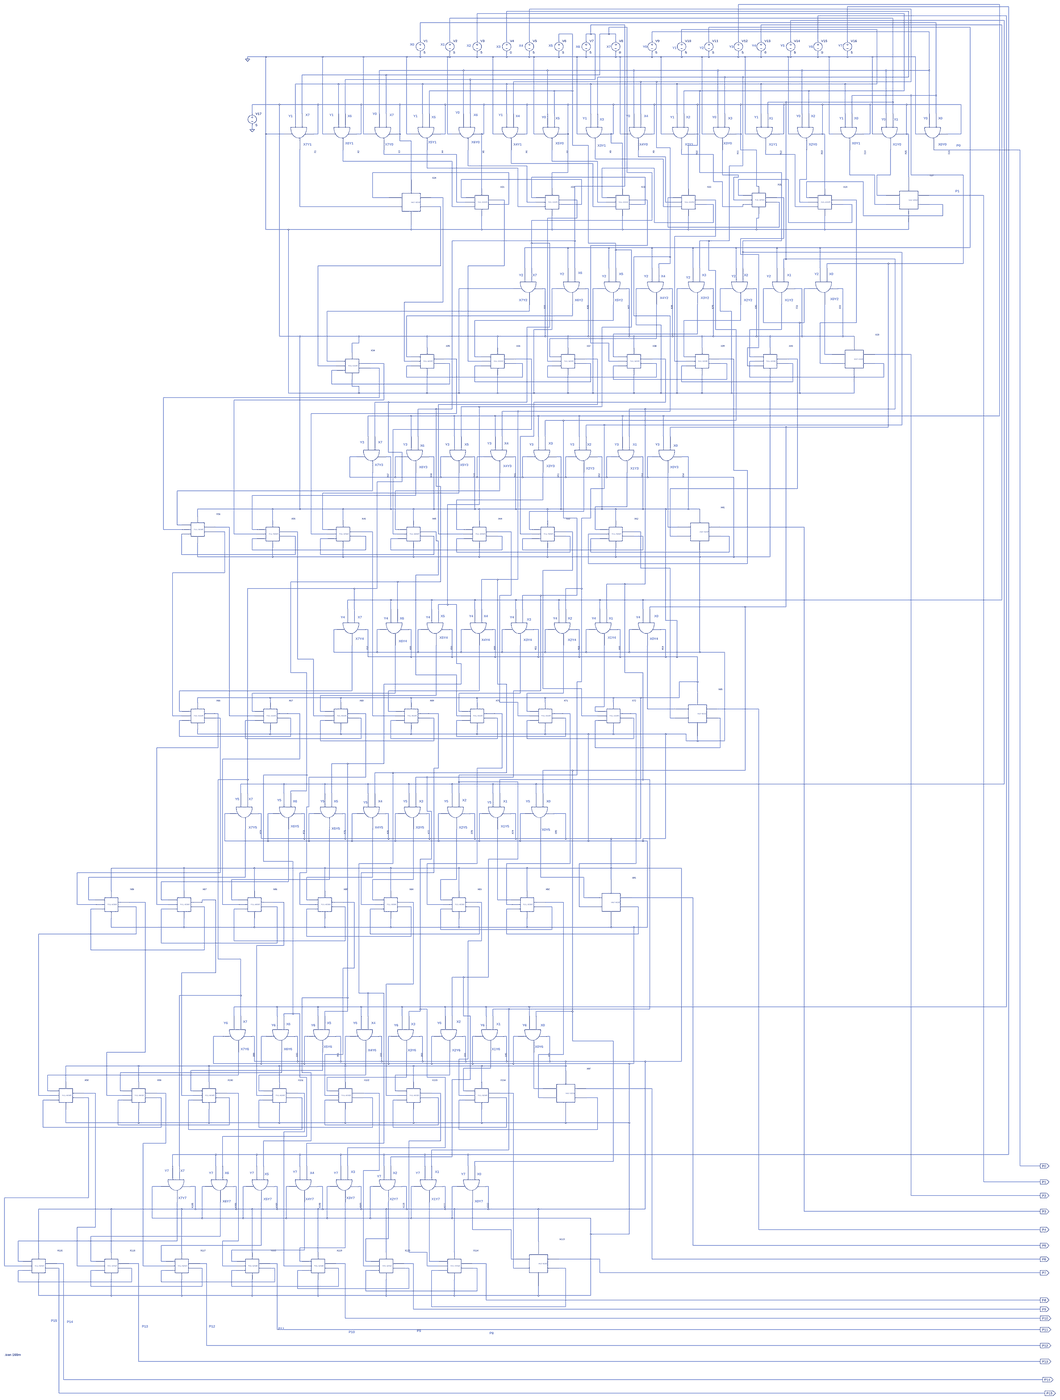
[diagram p0: schematic multi8bitimply.asc, whole sheet]
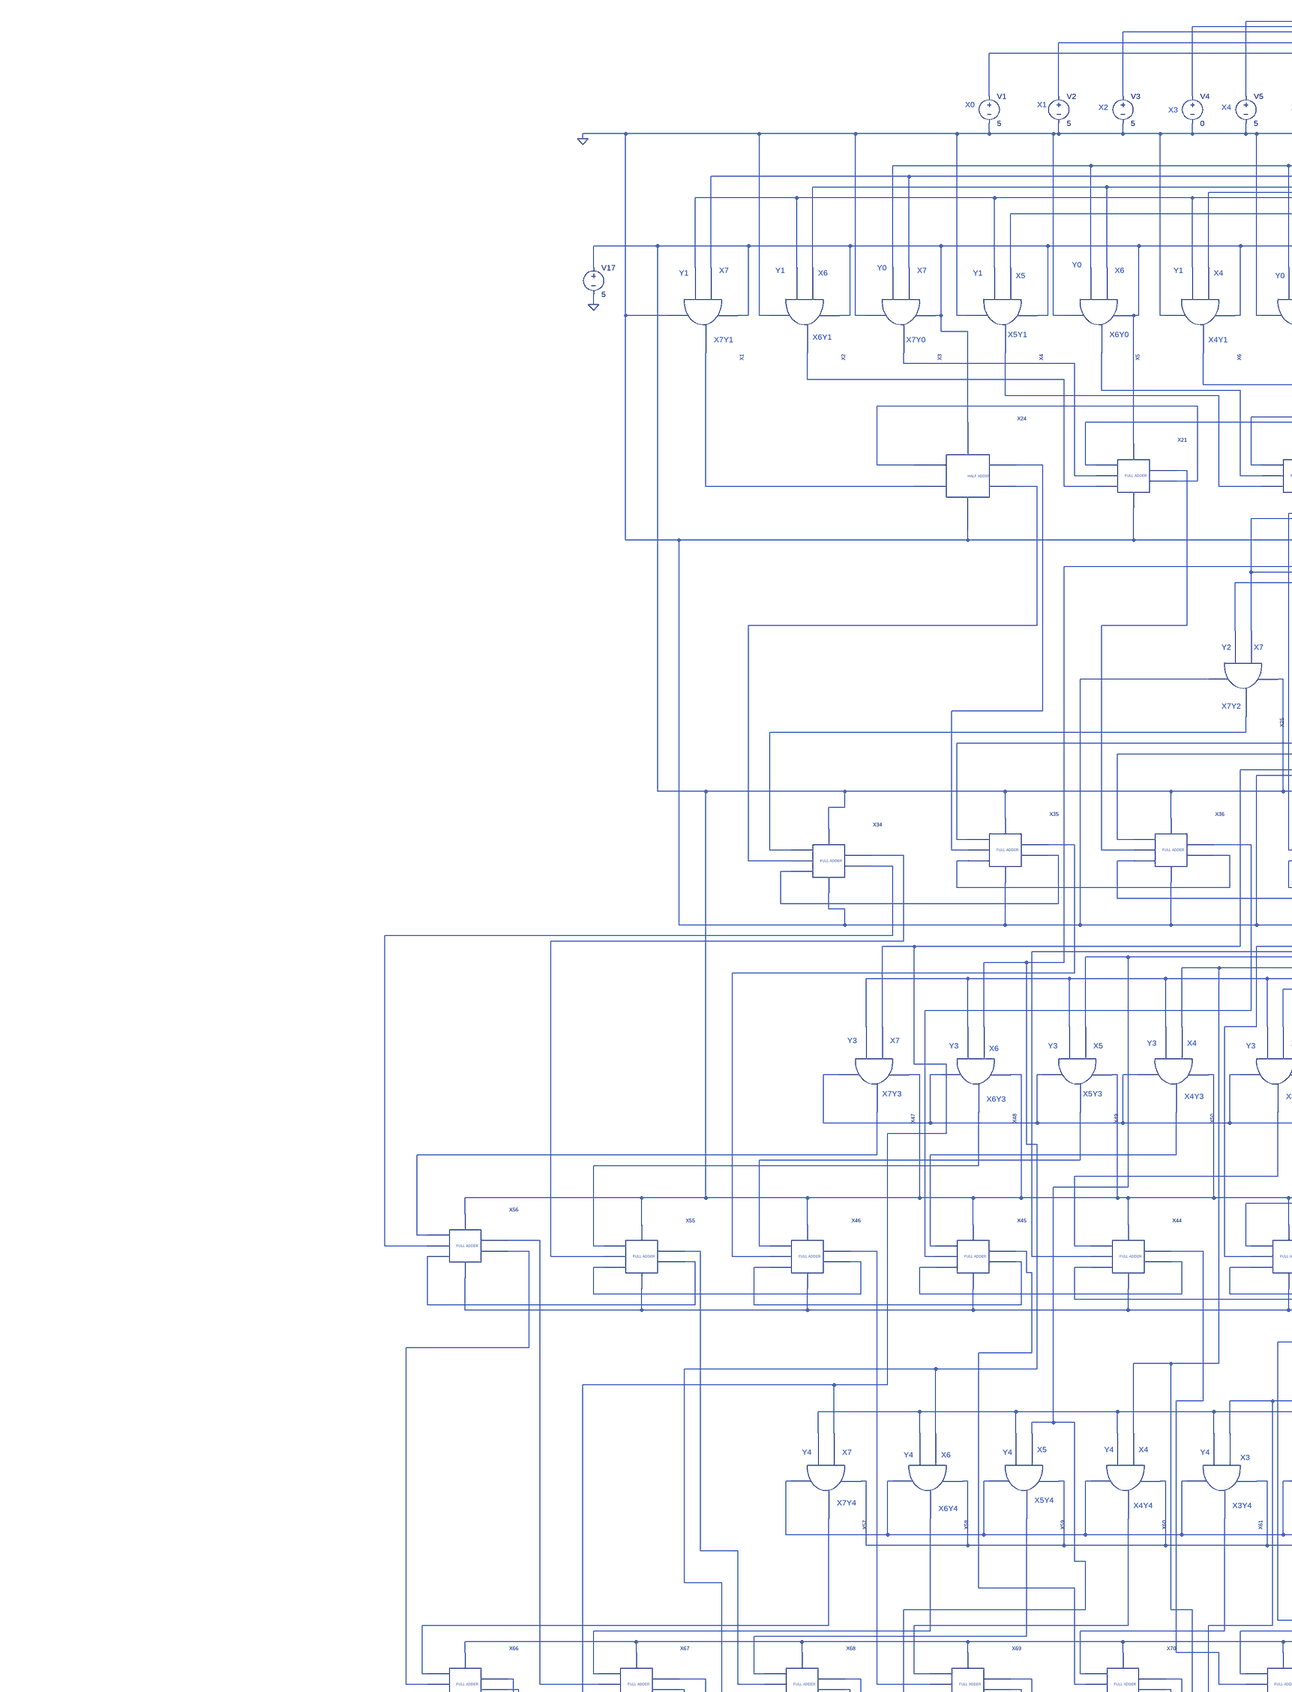
[diagram p1: schematic multi8bitimply.asc, part, row 1 of 2, column 1 of 2]
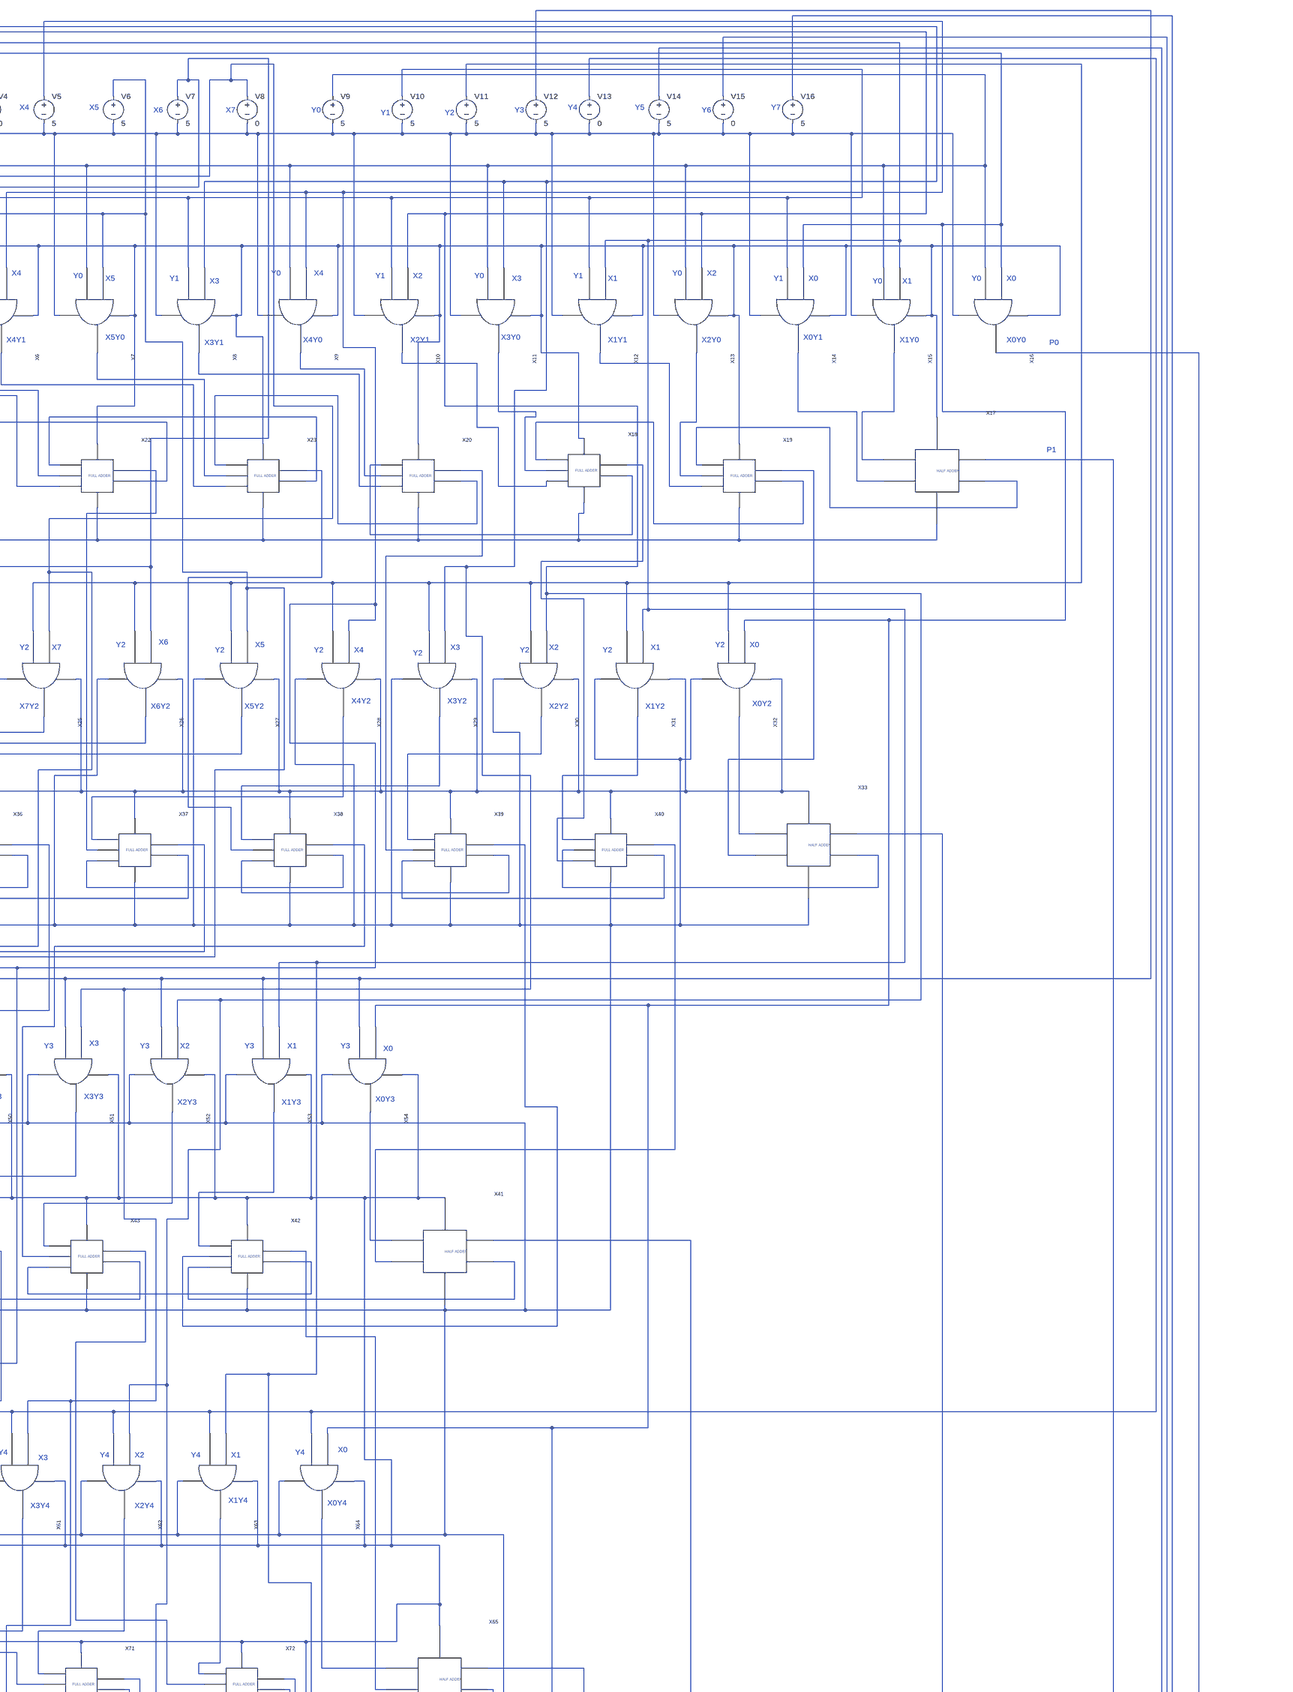
[diagram p2: schematic multi8bitimply.asc, part, row 1 of 2, column 2 of 2]
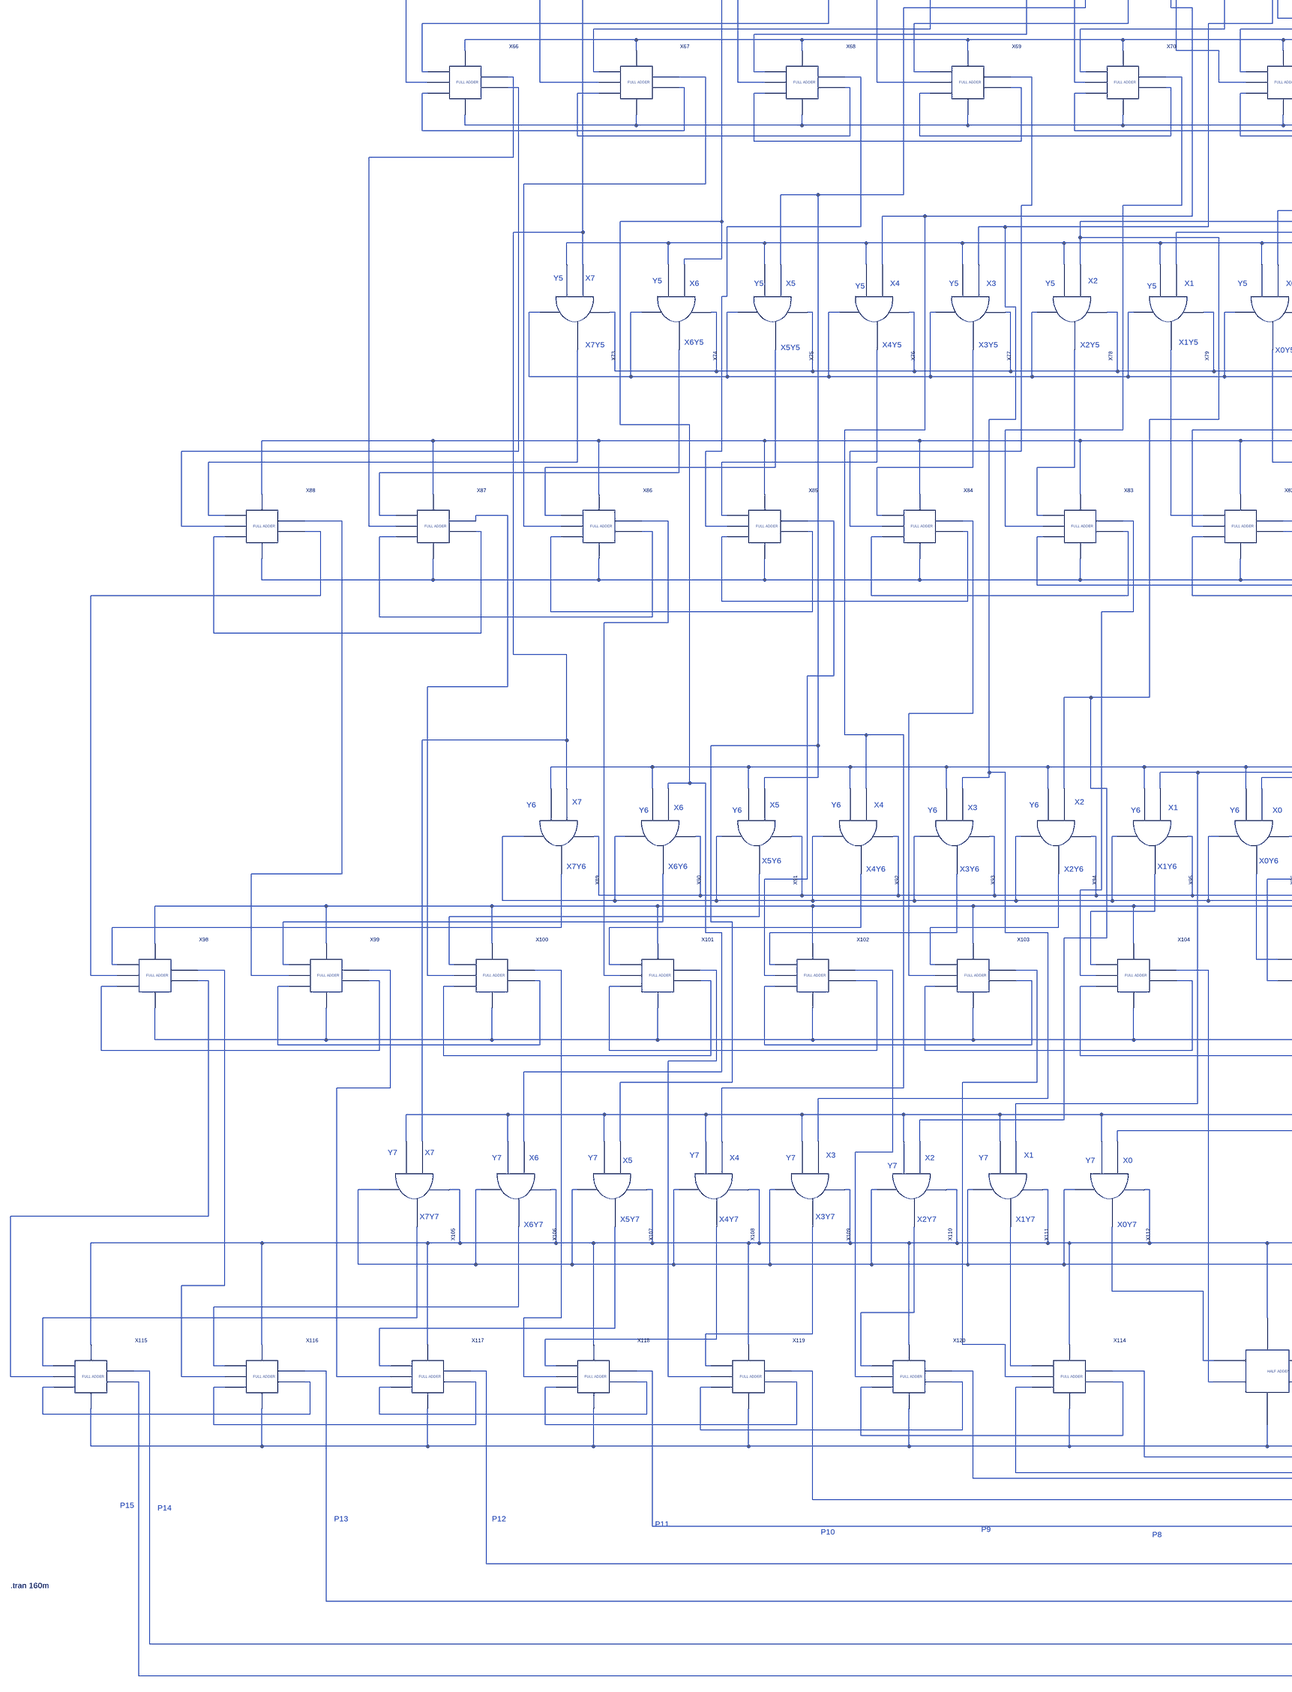
[diagram p3: schematic multi8bitimply.asc, part, row 2 of 2, column 1 of 2]
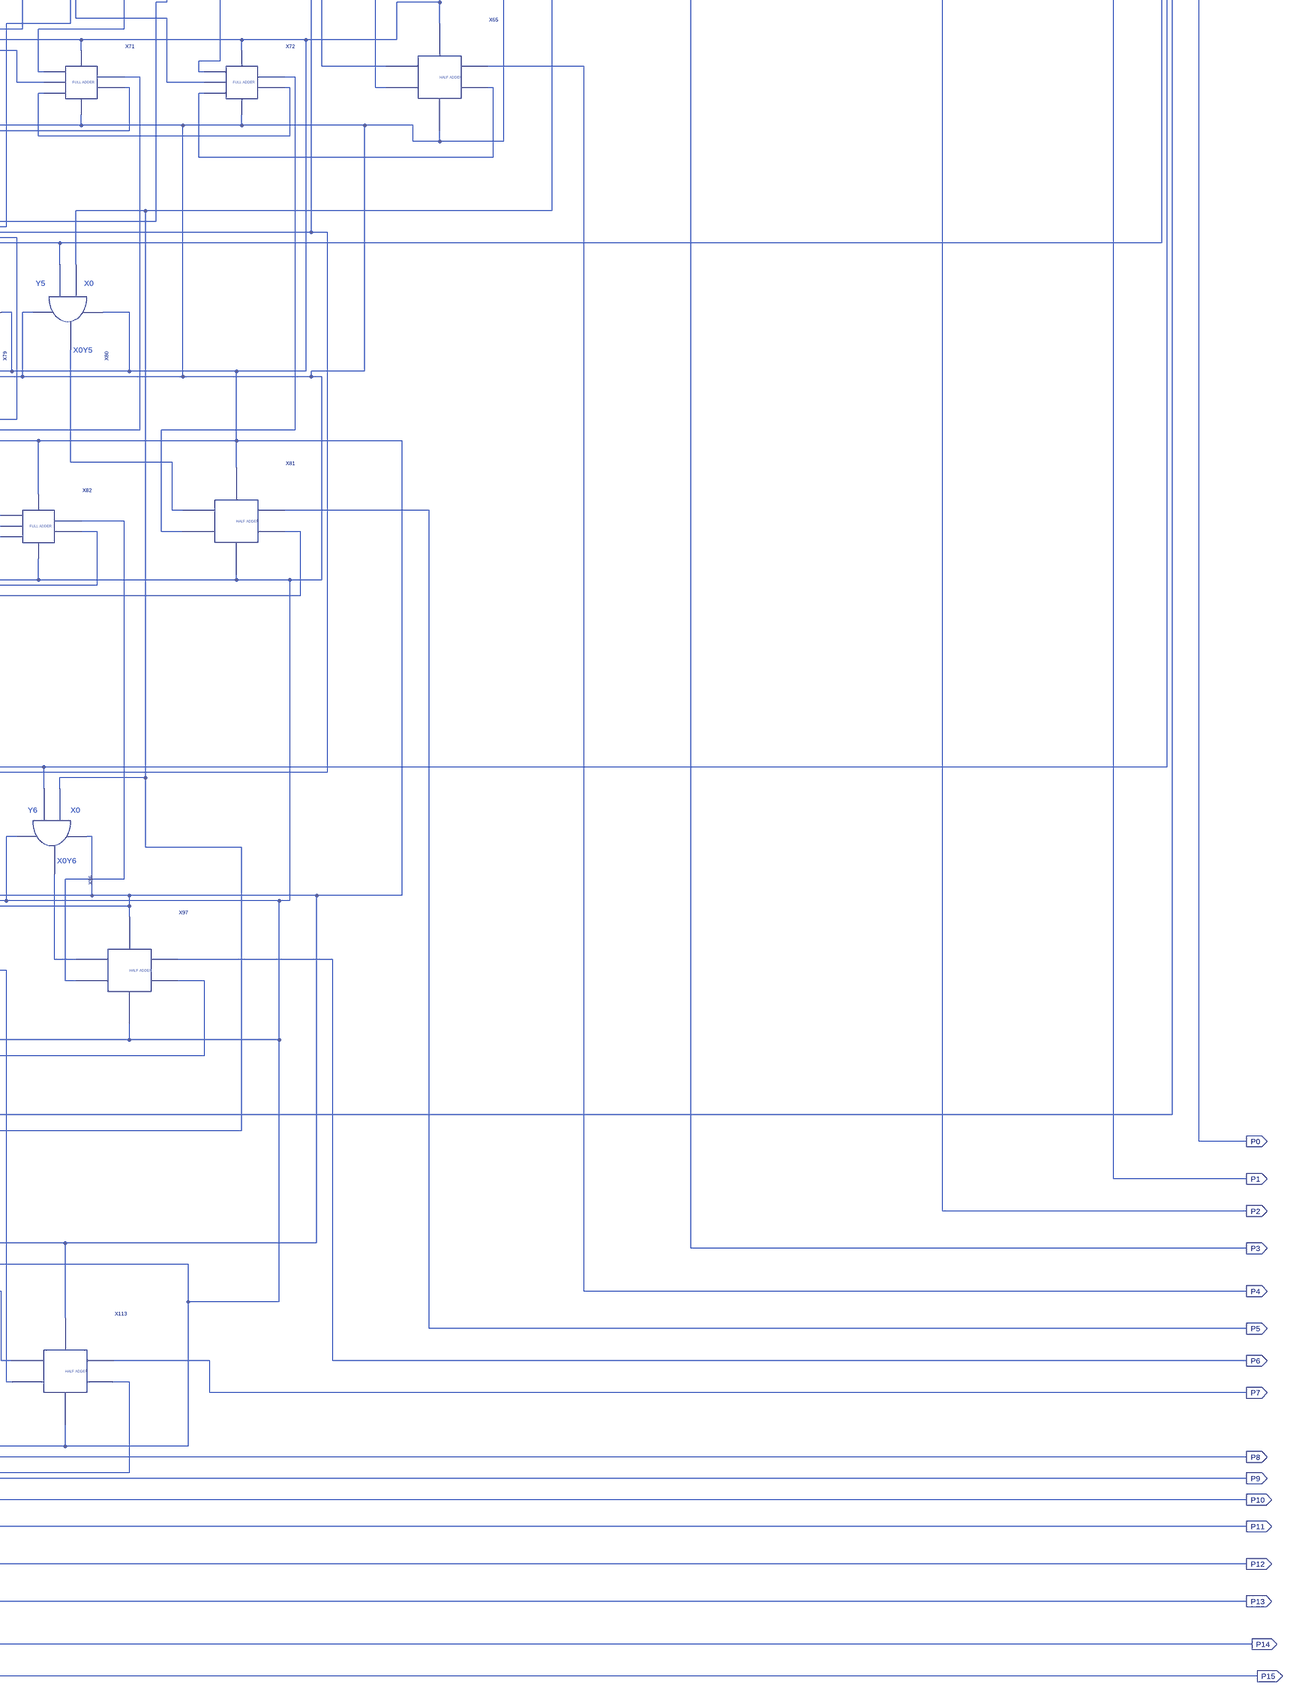
[diagram p4: schematic multi8bitimply.asc, part, row 2 of 2, column 2 of 2]
* multi8bitimply.asc
V1 N009 0 5
V2 N007 0 5
V3 N005 0 5
V4 N004 0 0
V5 N003 0 5
V6 N016 0 5
V7 N010 0 5
V8 N012 0 0
V9 N015 0 5
V10 N014 0 5
V11 N013 0 5
V12 N001 0 5
V13 N011 0 0
V14 N008 0 5
V15 N006 0 0
V16 N002 0 5
XX1 N017 0 N012 N014 N046 andgateimply  ; pins VDD VSS A B OUT
XX2 N017 0 N010 N014 N023 andgateimply  ; pins VDD VSS A B OUT
XX3 N017 0 N012 N015 N018 andgateimply  ; pins VDD VSS A B OUT
XX4 N017 0 N016 N014 N027 andgateimply  ; pins VDD VSS A B OUT
XX5 N017 0 N010 N015 N026 andgateimply  ; pins VDD VSS A B OUT
XX6 N017 0 N003 N014 N025 andgateimply  ; pins VDD VSS A B OUT
XX7 N017 0 N016 N015 N024 andgateimply  ; pins VDD VSS A B OUT
XX8 N017 0 N004 N014 N022 andgateimply  ; pins VDD VSS A B OUT
XX9 N017 0 N003 N015 N021 andgateimply  ; pins VDD VSS A B OUT
XX10 N017 0 N005 N014 N019 andgateimply  ; pins VDD VSS A B OUT
XX11 N017 0 N004 N015 N030 andgateimply  ; pins VDD VSS A B OUT
XX12 N017 0 N007 N014 N020 andgateimply  ; pins VDD VSS A B OUT
XX13 N017 0 N005 N015 N036 andgateimply  ; pins VDD VSS A B OUT
XX14 N017 0 N009 N014 N031 andgateimply  ; pins VDD VSS A B OUT
XX15 N017 0 N007 N015 N032 andgateimply  ; pins VDD VSS A B OUT
XX16 N017 0 N009 N015 P0 andgateimply  ; pins VDD VSS A B OUT
XX17 N032 N031 N017 0 P1 N037 halfadderimply  ; pins A B VDD VSS SUM COUT
XX24 N029 N046 N017 0 N038 N047 halfadderimply  ; pins A B VDD VSS SUM COUT
XX25 N017 0 N012 N013 N048 andgateimply  ; pins VDD VSS A B OUT
XX26 N017 0 N010 N013 N049 andgateimply  ; pins VDD VSS A B OUT
XX27 N017 0 N016 N013 N050 andgateimply  ; pins VDD VSS A B OUT
XX28 N017 0 N003 N013 N054 andgateimply  ; pins VDD VSS A B OUT
XX29 N017 0 N004 N013 N053 andgateimply  ; pins VDD VSS A B OUT
XX30 N017 0 N005 N013 N051 andgateimply  ; pins VDD VSS A B OUT
XX31 N017 0 N007 N013 N052 andgateimply  ; pins VDD VSS A B OUT
XX32 N017 0 N009 N013 N055 andgateimply  ; pins VDD VSS A B OUT
XX33 N055 N045 N017 0 P2 N062 halfadderimply  ; pins A B VDD VSS SUM COUT
XX47 N017 0 N012 N001 N071 andgateimply  ; pins VDD VSS A B OUT
XX48 N017 0 N010 N001 N074 andgateimply  ; pins VDD VSS A B OUT
XX49 N017 0 N016 N001 N073 andgateimply  ; pins VDD VSS A B OUT
XX50 N017 0 N003 N001 N072 andgateimply  ; pins VDD VSS A B OUT
XX51 N017 0 N004 N001 N075 andgateimply  ; pins VDD VSS A B OUT
XX52 N017 0 N005 N001 N077 andgateimply  ; pins VDD VSS A B OUT
XX53 N017 0 N007 N001 N076 andgateimply  ; pins VDD VSS A B OUT
XX54 N017 0 N009 N001 N079 andgateimply  ; pins VDD VSS A B OUT
XX41 N079 N061 N017 0 P3 N093 halfadderimply  ; pins A B VDD VSS SUM COUT
XX57 N017 0 N012 N011 N094 andgateimply  ; pins VDD VSS A B OUT
XX58 N017 0 N010 N011 N096 andgateimply  ; pins VDD VSS A B OUT
XX59 N017 0 N016 N011 N099 andgateimply  ; pins VDD VSS A B OUT
XX60 N017 0 N003 N011 N095 andgateimply  ; pins VDD VSS A B OUT
XX61 N017 0 N004 N011 N097 andgateimply  ; pins VDD VSS A B OUT
XX62 N017 0 N005 N011 N098 andgateimply  ; pins VDD VSS A B OUT
XX63 N017 0 N007 N011 N100 andgateimply  ; pins VDD VSS A B OUT
XX64 N017 0 N009 N011 N101 andgateimply  ; pins VDD VSS A B OUT
XX65 N101 N086 N017 0 P4 N116 halfadderimply  ; pins A B VDD VSS SUM COUT
XX73 N017 0 N012 N008 N117 andgateimply  ; pins VDD VSS A B OUT
XX74 N017 0 N010 N008 N123 andgateimply  ; pins VDD VSS A B OUT
XX75 N017 0 N016 N008 N120 andgateimply  ; pins VDD VSS A B OUT
XX76 N017 0 N003 N008 N118 andgateimply  ; pins VDD VSS A B OUT
XX77 N017 0 N004 N008 N121 andgateimply  ; pins VDD VSS A B OUT
XX78 N017 0 N005 N008 N122 andgateimply  ; pins VDD VSS A B OUT
XX79 N017 0 N007 N008 N125 andgateimply  ; pins VDD VSS A B OUT
XX80 N017 0 N009 N008 N119 andgateimply  ; pins VDD VSS A B OUT
XX81 N119 N108 N017 0 P5 N139 halfadderimply  ; pins A B VDD VSS SUM COUT
XX89 N017 0 N012 N006 N143 andgateimply  ; pins VDD VSS A B OUT
XX90 N017 0 N010 N006 N142 andgateimply  ; pins VDD VSS A B OUT
XX91 N017 0 N016 N006 N141 andgateimply  ; pins VDD VSS A B OUT
XX92 N017 0 N003 N006 N144 andgateimply  ; pins VDD VSS A B OUT
XX93 N017 0 N004 N006 N146 andgateimply  ; pins VDD VSS A B OUT
XX94 N017 0 N005 N006 N145 andgateimply  ; pins VDD VSS A B OUT
XX95 N017 0 N007 N006 N140 andgateimply  ; pins VDD VSS A B OUT
XX96 N017 0 N009 N006 N147 andgateimply  ; pins VDD VSS A B OUT
XX97 N147 N131 N017 0 P6 N162 halfadderimply  ; pins A B VDD VSS SUM COUT
XX105 N017 0 N012 N002 N166 andgateimply  ; pins VDD VSS A B OUT
XX106 N017 0 N010 N002 N164 andgateimply  ; pins VDD VSS A B OUT
XX107 N017 0 N016 N002 N167 andgateimply  ; pins VDD VSS A B OUT
XX108 N017 0 N003 N002 N169 andgateimply  ; pins VDD VSS A B OUT
XX109 N017 0 N004 N002 N168 andgateimply  ; pins VDD VSS A B OUT
XX110 N017 0 N005 N002 N165 andgateimply  ; pins VDD VSS A B OUT
XX111 N017 0 N007 N002 N170 andgateimply  ; pins VDD VSS A B OUT
XX112 N017 0 N009 N002 N163 andgateimply  ; pins VDD VSS A B OUT
XX113 N163 N154 N017 0 P7 N177 halfadderimply  ; pins A B VDD VSS SUM COUT
XX20 N039 N021 N022 N017 0 N028 N044 fulladderimply  ; pins A B C VDD VSS CARRY SUM
XX21 N034 N018 N023 N017 0 N029 N041 fulladderimply  ; pins A B C VDD VSS CARRY SUM
XX22 N033 N026 N027 N017 0 N034 N042 fulladderimply  ; pins A B C VDD VSS CARRY SUM
XX23 N028 N024 N025 N017 0 N033 N043 fulladderimply  ; pins A B C VDD VSS CARRY SUM
XX34 N048 N047 N064 N017 0 N070 N063 fulladderimply  ; pins A B C VDD VSS CARRY SUM
XX35 N049 N038 N065 N017 0 N064 N056 fulladderimply  ; pins A B C VDD VSS CARRY SUM
XX36 N050 N041 N066 N017 0 N065 N057 fulladderimply  ; pins A B C VDD VSS CARRY SUM
XX37 N054 N042 N067 N017 0 N066 N058 fulladderimply  ; pins A B C VDD VSS CARRY SUM
XX38 N053 N043 N068 N017 0 N067 N059 fulladderimply  ; pins A B C VDD VSS CARRY SUM
XX39 N051 N044 N069 N017 0 N068 N060 fulladderimply  ; pins A B C VDD VSS CARRY SUM
XX40 N052 N062 N040 N017 0 N069 N061 fulladderimply  ; pins A B C VDD VSS CARRY SUM
XX42 N076 N060 N093 N017 0 N092 N086 fulladderimply  ; pins A B C VDD VSS CARRY SUM
XX43 N077 N059 N092 N017 0 N091 N085 fulladderimply  ; pins A B C VDD VSS CARRY SUM
XX44 N075 N058 N091 N017 0 N090 N084 fulladderimply  ; pins A B C VDD VSS CARRY SUM
XX45 N072 N057 N090 N017 0 N089 N083 fulladderimply  ; pins A B C VDD VSS CARRY SUM
XX46 N073 N056 N089 N017 0 N088 N082 fulladderimply  ; pins A B C VDD VSS CARRY SUM
XX55 N074 N063 N088 N017 0 N087 N081 fulladderimply  ; pins A B C VDD VSS CARRY SUM
XX56 N071 N070 N087 N017 0 N080 N078 fulladderimply  ; pins A B C VDD VSS CARRY SUM
XX66 N094 N080 N110 N017 0 N109 N102 fulladderimply  ; pins A B C VDD VSS CARRY SUM
XX67 N096 N078 N111 N017 0 N110 N103 fulladderimply  ; pins A B C VDD VSS CARRY SUM
XX68 N099 N081 N112 N017 0 N111 N104 fulladderimply  ; pins A B C VDD VSS CARRY SUM
XX69 N095 N082 N113 N017 0 N112 N105 fulladderimply  ; pins A B C VDD VSS CARRY SUM
XX70 N097 N083 N114 N017 0 N113 N106 fulladderimply  ; pins A B C VDD VSS CARRY SUM
XX71 N098 N084 N115 N017 0 N114 N107 fulladderimply  ; pins A B C VDD VSS CARRY SUM
XX72 N100 N085 N116 N017 0 N115 N108 fulladderimply  ; pins A B C VDD VSS CARRY SUM
XX82 N125 N107 N139 N017 0 N138 N131 fulladderimply  ; pins A B C VDD VSS CARRY SUM
XX83 N122 N106 N138 N017 0 N137 N130 fulladderimply  ; pins A B C VDD VSS CARRY SUM
XX84 N121 N105 N137 N017 0 N136 N129 fulladderimply  ; pins A B C VDD VSS CARRY SUM
XX85 N118 N104 N136 N017 0 N135 N128 fulladderimply  ; pins A B C VDD VSS CARRY SUM
XX86 N120 N103 N135 N017 0 N134 N127 fulladderimply  ; pins A B C VDD VSS CARRY SUM
XX87 N123 N102 N134 N017 0 N133 N124 fulladderimply  ; pins A B C VDD VSS CARRY SUM
XX88 N117 N109 N133 N017 0 N132 N126 fulladderimply  ; pins A B C VDD VSS CARRY SUM
XX98 N143 N132 N156 N017 0 N155 N148 fulladderimply  ; pins A B C VDD VSS CARRY SUM
XX99 N142 N126 N157 N017 0 N156 N149 fulladderimply  ; pins A B C VDD VSS CARRY SUM
XX100 N141 N124 N158 N017 0 N157 N150 fulladderimply  ; pins A B C VDD VSS CARRY SUM
XX101 N144 N127 N159 N017 0 N158 N151 fulladderimply  ; pins A B C VDD VSS CARRY SUM
XX102 N146 N128 N160 N017 0 N159 N152 fulladderimply  ; pins A B C VDD VSS CARRY SUM
XX103 N145 N129 N161 N017 0 N160 N153 fulladderimply  ; pins A B C VDD VSS CARRY SUM
XX104 N140 N130 N162 N017 0 N161 N154 fulladderimply  ; pins A B C VDD VSS CARRY SUM
XX115 N166 N155 N171 N017 0 P15 P14 fulladderimply  ; pins A B C VDD VSS CARRY SUM
XX116 N164 N148 N172 N017 0 N171 P13 fulladderimply  ; pins A B C VDD VSS CARRY SUM
XX117 N167 N149 N173 N017 0 N172 P12 fulladderimply  ; pins A B C VDD VSS CARRY SUM
XX118 N169 N150 N174 N017 0 N173 P11 fulladderimply  ; pins A B C VDD VSS CARRY SUM
XX119 N168 N151 N175 N017 0 N174 P10 fulladderimply  ; pins A B C VDD VSS CARRY SUM
XX120 N165 N152 N176 N017 0 N175 P9 fulladderimply  ; pins A B C VDD VSS CARRY SUM
XX114 N170 N153 N177 N017 0 N176 P8 fulladderimply  ; pins A B C VDD VSS CARRY SUM
XX18 N035 N030 N019 N017 0 N039 N040 fulladderimply  ; pins A B C VDD VSS CARRY SUM
XX19 N037 N036 N020 N017 0 N035 N045 fulladderimply  ; pins A B C VDD VSS CARRY SUM
V17 N017 0 5
* X0
* X1
* X2
* X3
* X4
* X5
* X6
* X7
* Y0
* Y1
* Y2
* Y3
* Y4
* Y5
* Y6
* Y7
* X0Y0
* Y0
* X0
* X1
* Y0
* X1Y0
* X0
* Y1
* X0Y1
* Y0
* Y0
* Y0
* Y0
* Y0
* Y0
* Y1
* Y1
* Y1
* Y1
* Y1
* Y1
* Y1
* X2
* X2Y0
* X1
* X1Y1
* X3
* X3Y0
* X2
* X2Y1
* X4
* X4Y0
* X3
* X3Y1
* X5
* X5Y0
* X4
* X4Y1
* X6
* X6Y0
* X5
* X5Y1
* X7
* X7Y0
* X6
* X7
* X7Y1
* X6Y1
* P0
* P1
* X0
* Y2
* Y2
* Y2
* Y2
* Y2
* Y2
* Y2
* Y2
* X7
* X6
* X5
* X4
* X3
* X2
* X1
* X0Y2
* X7Y2
* X1Y2
* X2Y2
* X3Y2
* X4Y2
* X5Y2
* X6Y2
* Y3
* Y3
* Y3
* Y3
* Y3
* Y3
* Y3
* Y3
* X7
* X6
* X5
* X4
* X3
* X2
* X1
* X0
* X0Y3
* X1Y3
* X2Y3
* X3Y3
* X4Y3
* X5Y3
* X6Y3
* X7Y3
* Y4
* Y4
* Y4
* Y4
* Y4
* Y4
* Y4
* Y4
* X0
* X1
* X2
* X3
* X4
* X5
* X6
* X7
* X0Y4
* X1Y4
* X2Y4
* X3Y4
* X4Y4
* X5Y4
* X6Y4
* X7Y4
* Y5
* Y5
* Y5
* Y5
* Y5
* Y5
* Y5
* Y5
* X7
* X6
* X5
* X4
* X3
* X2
* X1
* X0
* Y6
* Y6
* Y6
* Y6
* Y6
* Y6
* Y6
* Y6
* X0
* X1
* X2
* X3
* X4
* X5
* X6
* X7
* P8
* P9
* P10
* P11
* P12
* P13
* P14
* P15
.tran 160m
* Y7
* Y7
* Y7
* Y7
* Y7
* Y7
* Y7
* Y7
* X7
* X6
* X5
* X4
* X3
* X2
* X1
* X0
* X0Y5
* X1Y5
* X2Y5
* X3Y5
* X4Y5
* X5Y5
* X6Y5
* X7Y5
* X0Y6
* X1Y6
* X2Y6
* X3Y6
* X4Y6
* X5Y6
* X6Y6
* X7Y6
* X7Y7
* X6Y7
* X5Y7
* X4Y7
* X3Y7
* X2Y7
* X1Y7
* X0Y7
.backanno
.end